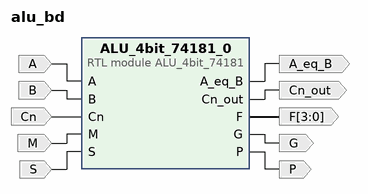
[diagram p0: block diagram of the top level]
# Vivado block design alu_bd, xc7z020clg400-1, Vivado 2022.2
create_bd_design alu_bd

create_bd_port -dir I A
create_bd_port -dir I B
create_bd_port -dir I S
create_bd_port -dir I M
create_bd_port -dir I Cn
create_bd_port -dir O -from 3 -to 0 F
create_bd_port -dir O P
create_bd_port -dir O G
create_bd_port -dir O Cn_out
create_bd_port -dir O A_eq_B

create_bd_cell -type module -reference ALU_4bit_74181 ALU_4bit_74181_0

# ---- connections ----

connect_bd_net [get_bd_pins ALU_4bit_74181_0/A_eq_B] [get_bd_ports A_eq_B]
connect_bd_net [get_bd_pins ALU_4bit_74181_0/Cn_out] [get_bd_ports Cn_out]
connect_bd_net [get_bd_pins ALU_4bit_74181_0/F] [get_bd_ports F]
connect_bd_net [get_bd_pins ALU_4bit_74181_0/G] [get_bd_ports G]
connect_bd_net [get_bd_pins ALU_4bit_74181_0/P] [get_bd_ports P]
connect_bd_net [get_bd_ports A] [get_bd_pins ALU_4bit_74181_0/A]
connect_bd_net [get_bd_ports B] [get_bd_pins ALU_4bit_74181_0/B]
connect_bd_net [get_bd_ports Cn] [get_bd_pins ALU_4bit_74181_0/Cn]
connect_bd_net [get_bd_ports M] [get_bd_pins ALU_4bit_74181_0/M]
connect_bd_net [get_bd_ports S] [get_bd_pins ALU_4bit_74181_0/S]

validate_bd_design
save_bd_design
